# Altium project Attenuator_10x100x.PrjPcb
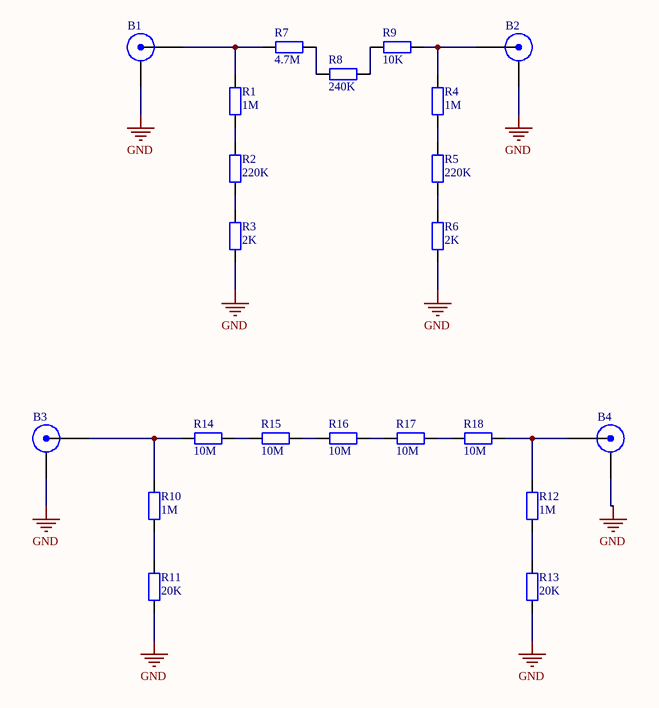
[diagram p0: Attenuator_10x100x.SchDoc]
1 sheet, 22 parts. Net scope: global (net labels, ports and power ports of the same name join across sheets).

## Sheet Attenuator_10x100x.SchDoc
size A4

### Parts
B1  BNC  [BNC-5P]  (value not drawn)
B2  BNC  [BNC-5P]  (value not drawn)
B3  BNC  [BNC-5P]  (value not drawn)
B4  BNC  [BNC-5P]  (value not drawn)
R1  1M  [RS 1/4W]
R2  220K  [RS 1/4W]
R3  2K  [RS 1/4W]
R4  1M  [RS 1/4W]
R5  220K  [RS 1/4W]
R6  2K  [RS 1/4W]
R7  4.7M  [RS 1/4W]
R8  240K  [RS 1/4W]
R9  10K  [RS 1/4W]
R10  1M  [RS 1/4W]
R11  20K  [RS 1/4W]
R12  1M  [RS 1/4W]
R13  20K  [RS 1/4W]
R14  10M  [RS 1/4W]
R15  10M  [RS 1/4W]
R16  10M  [RS 1/4W]
R17  10M  [RS 1/4W]
R18  10M  [RS 1/4W]

### Nets
GND: B1.2(Y) B2.2(Y) B3.2(Y) B4.2(Y) R3.1 R6.2 R11.1 R13.1
NetB1_1: B1.1(X) R1.2 R7.1
NetB2_1: B2.1(X) R4.2 R9.2
NetB3_1: B3.1(X) R10.2 R14.1
NetB4_1: B4.1(X) R12.2 R18.2
NetR1_1: R1.1 R2.2
NetR2_1: R2.1 R3.2
NetR4_1: R4.1 R5.2
NetR5_1: R5.1 R6.1
NetR7_2: R7.2 R8.1
NetR8_2: R8.2 R9.1
NetR10_1: R10.1 R11.2
NetR12_1: R12.1 R13.2
NetR14_2: R14.2 R15.1
NetR15_2: R15.2 R16.1
NetR16_2: R16.2 R17.1
NetR17_2: R17.2 R18.1

### Library data of the parts
B1-B4 = BNC_1: BNC Connector; Revision: 17-Jul-2002: Re-released for DXP Platform.; Publisher: Altium Limited
R1-R18 = R-CRR: 直插色环电阻; BOM名称: 色环电阻; 版权归属: 源创客; 学习资源: www.ooocke.com